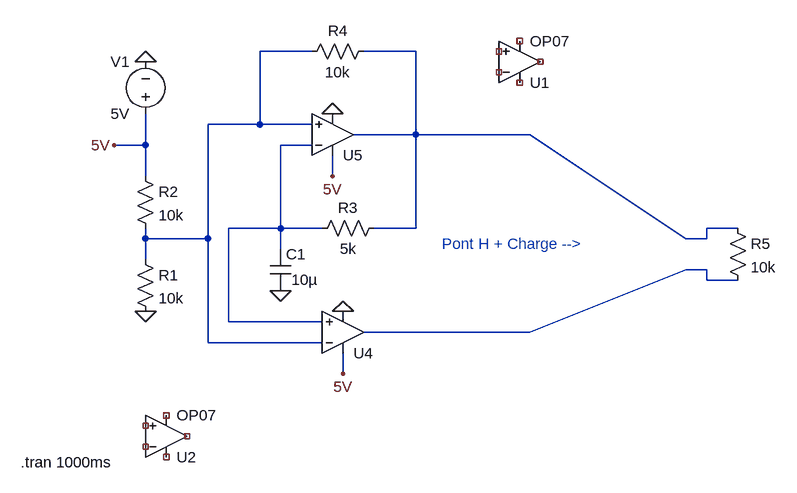
[diagram p0: schematic Draft1.asc]
Draft1.asc, the LTspice schematic file:
Version 4
SHEET 1 2520 680
WIRE 416 -208 336 -208
WIRE 576 -208 496 -208
WIRE 336 -96 336 -208
WIRE 336 -96 256 -96
WIRE 416 -96 336 -96
WIRE 576 -80 576 -208
WIRE 576 -80 480 -80
WIRE 752 -80 576 -80
WIRE 160 -64 160 -112
WIRE 160 -64 112 -64
WIRE 416 -64 368 -64
WIRE 160 -16 160 -64
WIRE 448 -16 448 -48
WIRE 368 64 368 -64
WIRE 368 64 288 64
WIRE 432 64 368 64
WIRE 576 64 576 -80
WIRE 576 64 512 64
WIRE 1072 64 1024 64
WIRE 160 80 160 64
WIRE 256 80 256 -96
WIRE 256 80 160 80
WIRE 992 80 752 -80
WIRE 1024 80 1024 64
WIRE 1024 80 992 80
WIRE 368 96 368 64
WIRE 160 112 160 80
WIRE 1024 128 992 128
WIRE 1024 144 1024 128
WIRE 1072 144 1024 144
WIRE 288 208 288 64
WIRE 432 208 288 208
WIRE 752 224 992 128
WIRE 752 224 496 224
WIRE 256 240 256 80
WIRE 432 240 256 240
WIRE 464 288 464 256
FLAG 368 160 0
FLAG 160 192 0
FLAG 464 192 0
FLAG 448 -112 0
FLAG 160 -192 0
FLAG 448 -16 5V
FLAG 464 288 5V
FLAG 112 -64 5V
SYMBOL res 144 96 R0
SYMATTR InstName R1
SYMATTR Value 10k
SYMBOL res 144 -32 R0
SYMATTR InstName R2
SYMATTR Value 10k
SYMBOL res 528 48 R90
WINDOW 0 0 56 VBottom 2
WINDOW 3 32 56 VTop 2
SYMATTR InstName R3
SYMATTR Value 5k
SYMBOL res 512 -224 R90
WINDOW 0 0 56 VBottom 2
WINDOW 3 32 56 VTop 2
SYMATTR InstName R4
SYMATTR Value 10k
SYMBOL cap 352 96 R0
WINDOW 3 33 47 Left 2
SYMATTR Value 10µ
SYMATTR InstName C1
SYMBOL Opamps\\OP07 736 -128 M180
SYMATTR InstName U1
SYMBOL Opamps\\OP07 192 448 M180
SYMATTR InstName U2
SYMBOL voltage 160 -96 R180
WINDOW 0 24 96 Left 2
WINDOW 3 24 16 Left 2
SYMATTR InstName V1
SYMATTR Value 5V
SYMBOL res 1056 48 R0
SYMATTR InstName R5
SYMATTR Value 10k
SYMBOL Opamps\\UniversalOpamp2 464 224 M180
SYMATTR InstName U4
SYMBOL Opamps\\UniversalOpamp2 448 -80 M180
SYMATTR InstName U5
TEXT -32 424 Left 2 !.tran 1000ms
TEXT 616 88 Left 2 ;Pont H + Charge -->

The netlist it stands for:
* Draft1.asc
R1 N001 0 10k
R2 5V N001 10k
R3 N002 N003 5k
R4 N002 N001 10k
C1 N003 0 10µ
XU1 NC_01 NC_02 NC_03 NC_04 NC_05 LT1001  ; OP07, pins In+ In- V+ V- OUT
XU2 NC_06 NC_07 NC_08 NC_09 NC_10 LT1001  ; OP07, pins In+ In- V+ V- OUT
V1 5V 0 5V
R5 N002 N004 10k
XU4 N003 N001 5V 0 N004 level.2 Avol=1Meg GBW=10Meg Slew=10Meg ilimit=25m rail=0 Vos=0 phimargin=45 en=0 enk=0 in=0 ink=0 Rin=500Meg  ; pins IN+ IN- V+ V- OUT
XU5 N001 N003 5V 0 N002 level.2 Avol=1Meg GBW=10Meg Slew=10Meg ilimit=25m rail=0 Vos=0 phimargin=45 en=0 enk=0 in=0 ink=0 Rin=500Meg  ; pins IN+ IN- V+ V- OUT
.tran 1000ms
* Pont H + Charge -->
.lib LTC.lib
.lib UniversalOpamps2.sub
.backanno
.end